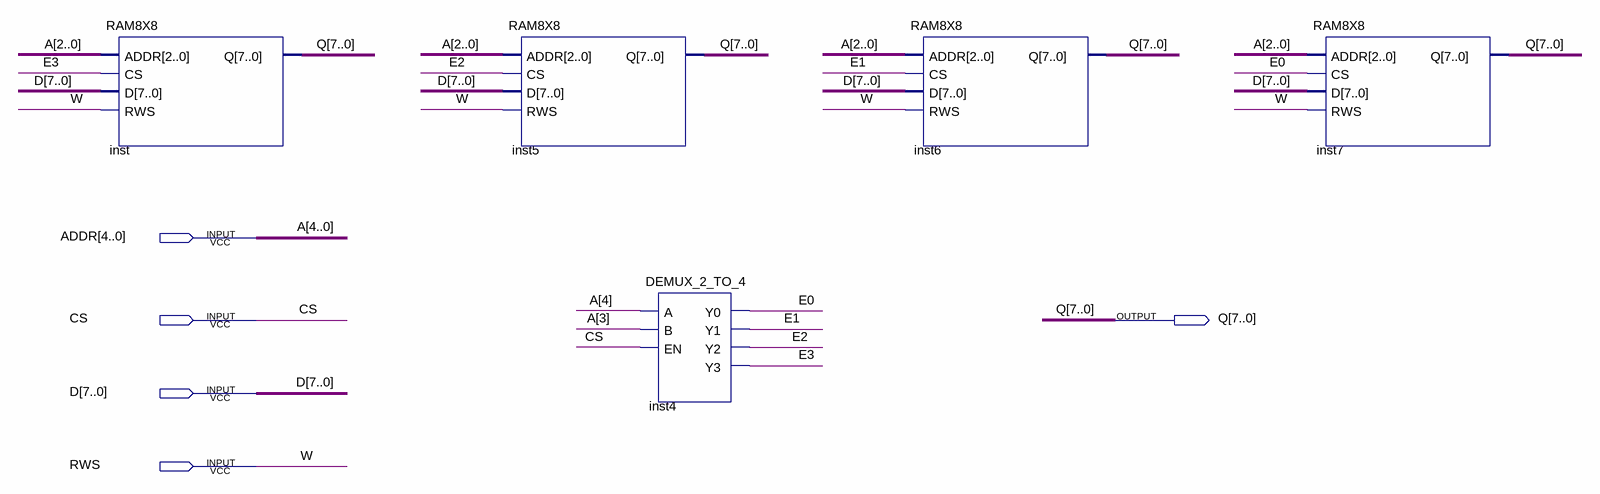
[diagram p0: schematic sheet]
// Quartus schematic RAM32X8.bdf as structural Verilog: 5 symbols, 5 pins
module RAM32X8 (
  input  [4:0] ADDR,
  input  CS,
  input  [7:0] D,
  input  RWS,
  output [7:0] Q
);

  wire E0, E1, E2, E3;

  RAM8X8 inst (.ADDR(ADDR[2:0]), .CS(E3), .D(D), .RWS(RWS), .Q(Q));
  RAM8X8 inst5 (.ADDR(ADDR[2:0]), .CS(E2), .D(D), .RWS(RWS), .Q(Q));
  DEMUX_2_TO_4 inst4 (.A(ADDR[4]), .B(ADDR[3]), .EN(CS), .Y0(E0), .Y1(E1), .Y2(E2), .Y3(E3));
  RAM8X8 inst6 (.ADDR(ADDR[2:0]), .CS(E1), .D(D), .RWS(RWS), .Q(Q));
  RAM8X8 inst7 (.ADDR(ADDR[2:0]), .CS(E0), .D(D), .RWS(RWS), .Q(Q));

  // Other names for the same wires on the sheet: A[4:0] = ADDR; W = RWS
endmodule
